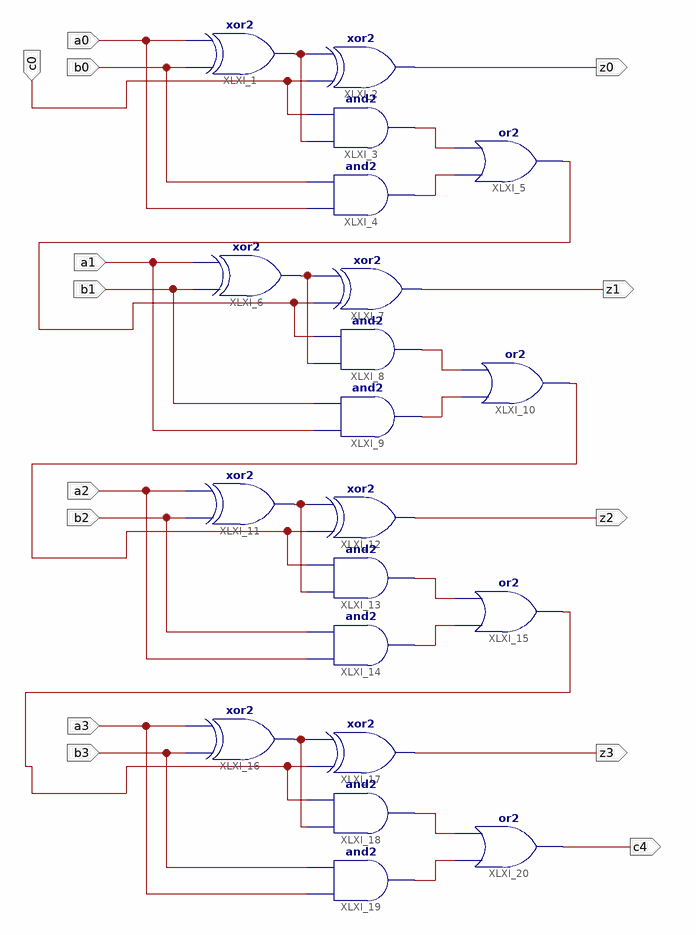
[diagram p0: schematic sheet 1]
// Xilinx ISE schematic full_adder_schematic.sch (spartan3e) as structural Verilog: 20 symbols, 14 ports
module full_adder_schematic (
  input  a0,
  input  b0,
  input  c0,
  input  a1,
  input  b1,
  input  a2,
  input  b2,
  input  a3,
  input  b3,
  output z0,
  output z1,
  output z2,
  output z3,
  output c4
);

  wire XLXN_3, XLXN_10, XLXN_11, XLXN_14, XLXN_17, XLXN_18, XLXN_19, XLXN_22, XLXN_25, XLXN_26, XLXN_27,
       XLXN_30, XLXN_32, XLXN_33, XLXN_34;

  xor XLXI_1 (XLXN_3, b0, a0);
  xor XLXI_2 (z0, c0, XLXN_3);
  and XLXI_3 (XLXN_11, XLXN_3, c0);
  and XLXI_4 (XLXN_10, a0, b0);
  or XLXI_5 (XLXN_19, XLXN_10, XLXN_11);
  xor XLXI_6 (XLXN_14, b1, a1);
  xor XLXI_7 (z1, XLXN_19, XLXN_14);
  and XLXI_8 (XLXN_18, XLXN_14, XLXN_19);
  and XLXI_9 (XLXN_17, a1, b1);
  or XLXI_10 (XLXN_27, XLXN_17, XLXN_18);
  xor XLXI_11 (XLXN_22, b2, a2);
  xor XLXI_12 (z2, XLXN_27, XLXN_22);
  and XLXI_13 (XLXN_26, XLXN_22, XLXN_27);
  and XLXI_14 (XLXN_25, a2, b2);
  or XLXI_15 (XLXN_32, XLXN_25, XLXN_26);
  xor XLXI_16 (XLXN_30, b3, a3);
  xor XLXI_17 (z3, XLXN_32, XLXN_30);
  and XLXI_18 (XLXN_34, XLXN_30, XLXN_32);
  and XLXI_19 (XLXN_33, a3, b3);
  or XLXI_20 (c4, XLXN_33, XLXN_34);
endmodule
